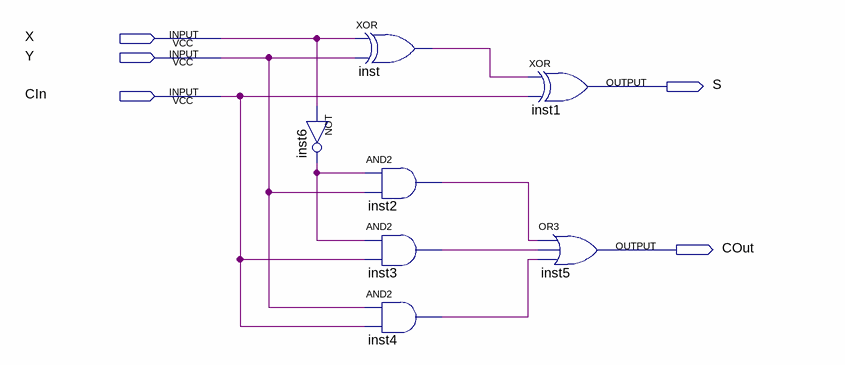
[diagram p0: schematic sheet]
// Quartus schematic Subtrator_Completo.bdf as structural Verilog: 7 symbols, 5 pins
module Subtrator_Completo (
  input  X,
  input  Y,
  input  CIn,
  output S,
  output COut
);

  wire inst2_out, inst3_out, inst4_out, inst6_out, inst_out;

  not inst6 (inst6_out, X);
  xor inst (inst_out, X, Y);
  and inst2 (inst2_out, inst6_out, Y);
  and inst3 (inst3_out, inst6_out, CIn);
  and inst4 (inst4_out, Y, CIn);
  xor inst1 (S, inst_out, CIn);
  or inst5 (COut, inst2_out, inst3_out, inst4_out);
endmodule
